# EAGLE design schema (EAGLE 4.13)
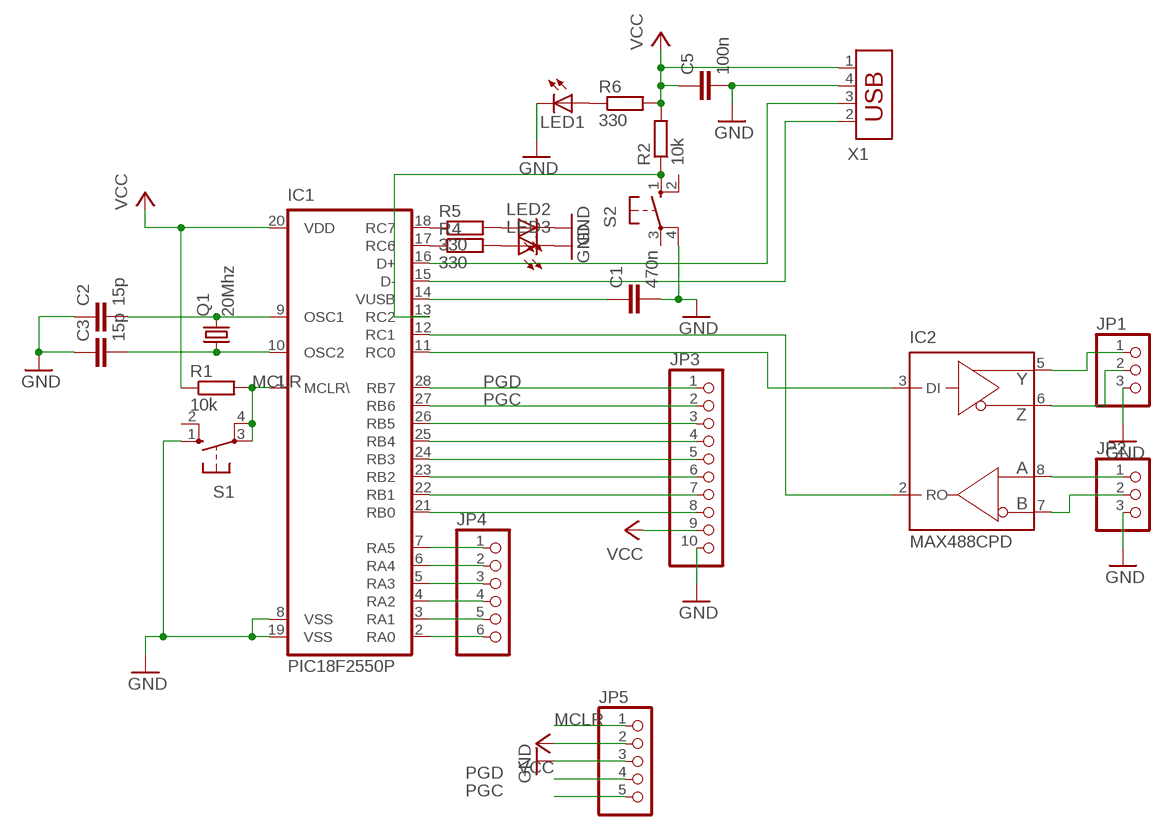
[diagram p0: schematic, sheet 1]

## Parts
C1  470n  C-EUC1206  [C1206]
C2  15p  C-EUC1206  [C1206]
C3  15p  C-EUC1206  [C1206]
C5  100n  C-EUC1206  [C1206]
IC1  PIC18F2550P  [DIL28-3]
IC2  MAX488CPD  [DIL08]
JP1  PINHD-1X3  [1X03]
JP2  PINHD-1X3  [1X03]
JP3  PINHD-1X10  [1X10]
JP4  PINHD-1X6  [1X06]
JP5  PINHD-1X5  [1X05]
LED1  LEDCHIPLED_1206  [CHIPLED_1206]
LED2  LEDCHIPLED_1206  [CHIPLED_1206]
LED3  LEDCHIPLED_1206  [CHIPLED_1206]
Q1  20Mhz  CRYTALHC49U-V  [HC49U-V]
R1  10k  R-EU_R1206  [R1206]
R2  10k  R-EU_R1206  [R1206]
R4  330  R-EU_R1206  [R1206]
R5  330  R-EU_R1206  [R1206]
R6  330  R-EU_R1206  [R1206]
S1  10-XX  [B3F-10XX]
S2  10-XX  [B3F-10XX]
X1  USB-787616  [USB]

## Nets
GND: C1.2 C2.1 C3.1 C5.2 IC1.8(VSS) IC1.19(VSS) JP1.3 JP2.3 JP3.10 JP5.3 LED1.C LED2.C LED3.C S1.1(S) S2.4(P1) X1.4
MCLR: IC1.1(MCLR\) JP5.1 R1.2 S1.3(P) S1.4(P1)
N$1: IC1.15(D-) X1.2
N$2: IC1.16(D+) X1.3
N$3: C1.1 IC1.14(VUSB)
N$4: C2.2 IC1.9(OSC1) Q1.2
N$5: C3.2 IC1.10(OSC2) Q1.1
N$6: IC1.11(RC0) IC2.3(DI)
N$8: IC1.12(RC1) IC2.2(RO)
N$9: IC1.7(RA5) JP4.1
N$10: IC1.13(RC2) R2.1 S2.1(S)
N$11: IC1.17(RC6) R4.1
N$12: IC1.18(RC7) R5.1
N$13: LED1.A R6.1
N$14: LED2.A R5.2
N$15: LED3.A R4.2
N$16: IC1.6(RA4) JP4.2
N$17: IC2.5(Y) JP1.1
N$18: IC2.6(Z) JP1.2
N$20: IC2.8(A) JP2.1
N$21: IC2.7(B) JP2.2
N$23: IC1.26(RB5) JP3.3
N$24: IC1.25(RB4) JP3.4
N$25: IC1.24(RB3) JP3.5
N$26: IC1.23(RB2) JP3.6
N$27: IC1.22(RB1) JP3.7
N$28: IC1.21(RB0) JP3.8
N$29: IC1.5(RA3) JP4.3
N$30: IC1.4(RA2) JP4.4
N$31: IC1.3(RA1) JP4.5
N$32: IC1.2(RA0) JP4.6
PGC: IC1.27(RB6) JP3.2 JP5.5
PGD: IC1.28(RB7) JP3.1 JP5.4
VCC: C5.1 IC1.20(VDD) JP3.9 JP5.2 R1.1 R2.2 R6.2 X1.1
Unconnected: S1.2(S1) S2.2(S1) S2.3(P)

## Power pins joined to a net without a drawn wire
GND: IC2.4(GND)
VCC: IC2.1(VCC)

## Library data of the parts
C1-C3 C5 = rcl:C-EU: CAPACITOR, European symbol
IC1 = PICs:PIC18F2550: MICROCONTROLLER EPROM/ROM-based
IC2 = maxim:MAX488: RS485 TRANSEIVER
JP1 JP2 = pinhead:PINHD-1X3: PIN HEADER
JP3 = pinhead:PINHD-1X10: PIN HEADER
JP4 = pinhead:PINHD-1X6: PIN HEADER
JP5 = pinhead:PINHD-1X5: PIN HEADER
LED1-LED3 = led:LED: LED OSRAM: - CHIPLED LG R971, LG N971, LY N971, LG Q971, LY Q971, LO R971, LY R971 LH N974, LH R974 LS Q976, LO Q976, LY Q976 LO Q996 - Hyper CHIPLED LW Q18S LB Q993, LB Q99A, LB R99A - SideLED LS A670, LO A670, LY A670, LG A670, LP A670 LB A673, LV A673, LT A673, LW A673 LH A674 LY A675 LS A676, LA A676, LO A676, LY A676, LW A676 LS A679, LY A679, LG A679 - Hyper Micro SIDELED® LS Y876, LA Y876, LO Y876, LY Y876 LT Y87S - SmartLED LW L88C, LW L88S LB L89C, LB L89S, LG L890 LS L89K, LO L89K, LY L89K LS L896, LA L896, LO L896, LY L896 - TOPLED LS T670, LO T670, LY T670, LG T670, LP T670 LSG T670, LSP T670, LSY T670, LOP T670, LYG T670 LG T671, LOG T671, LSG T671 LB T673, LV T673, LT T673, LW T673 LH T674 LS T676, LA T676, LO T676, LY T676, LB T676, LH T676, LSB T676, LW T676 LB T67C, LV T67C, LT T67C, LS T67K, LO T67K, LY T67K, LW E67C LS E67B, LA E67B, LO E67B, LY E67B, LB E67C, LV E67C, LT E67C LW T67C LS T679, LY T679, LG T679 LS T770, LO T770, LY T770, LG T770, LP T770 LB T773, LV T773, LT T773, LW T773 LH T774 LS E675, LA E675, LY E675, LS T675 LS T776, LA T776, LO T776, LY T776, LB T776 LHGB T686 LT T68C, LB T68C - Hyper Mini TOPLED® LB M676 - Mini TOPLED Santana® LG M470 LS M47K, LO M47K, LY M47K Source: http://www.osram.convergy.de/
Q1 = crystal:CRYTAL: CRYSTAL
R1 R2 R4-R6 = rcl:R-EU_: RESISTOR, European symbol
S1 S2 = switch-omron:10-XX: OMRON SWITCH
X1 = PICs:USB-787616: AMP connector

## Board
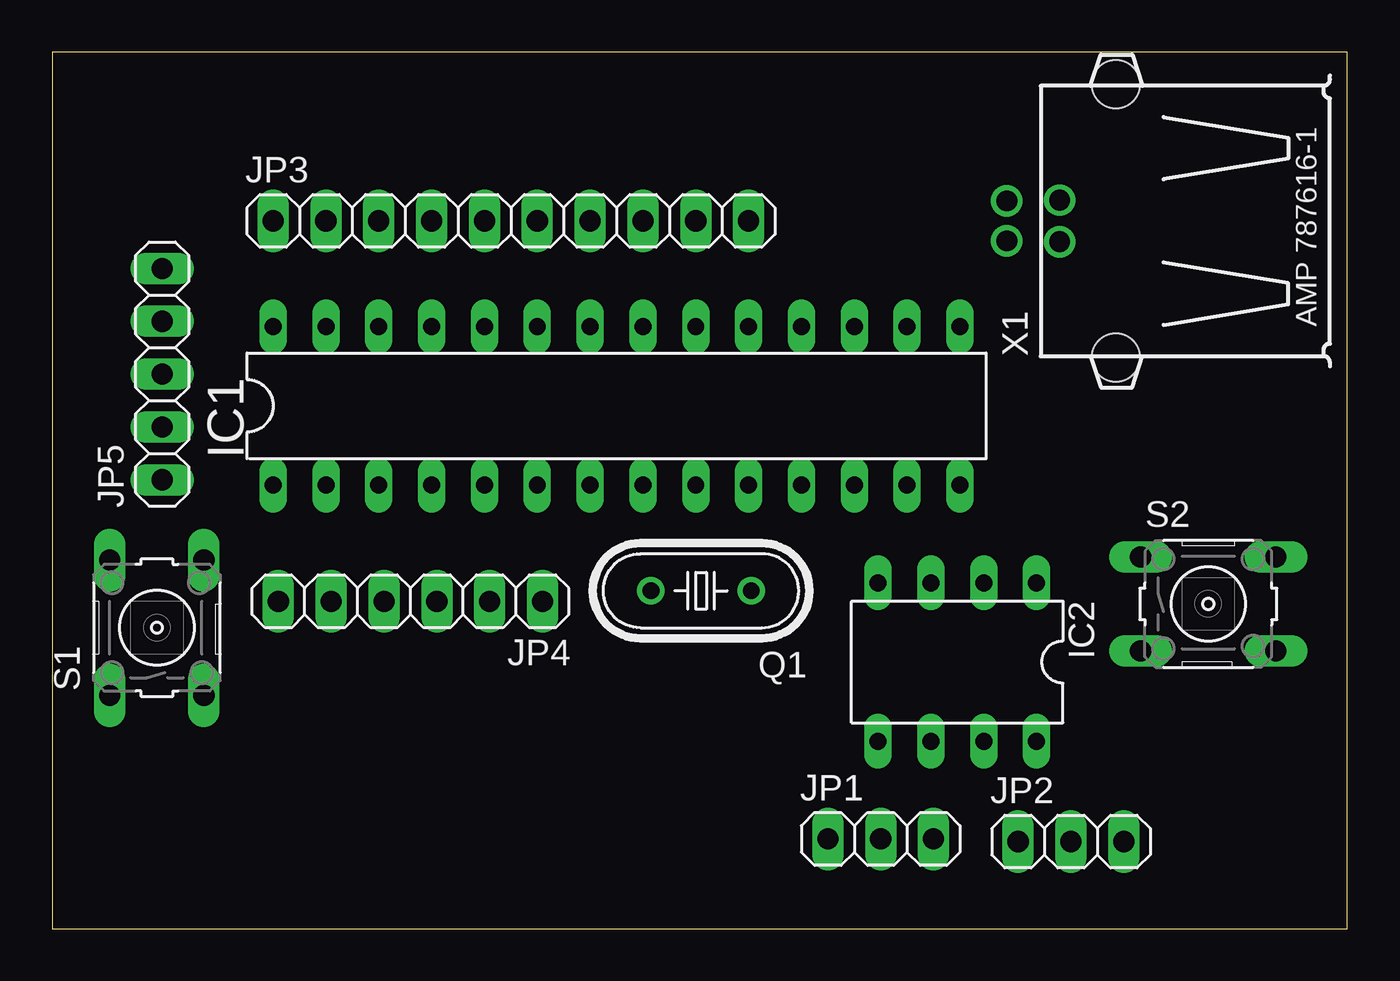
[diagram p1: board, top side]
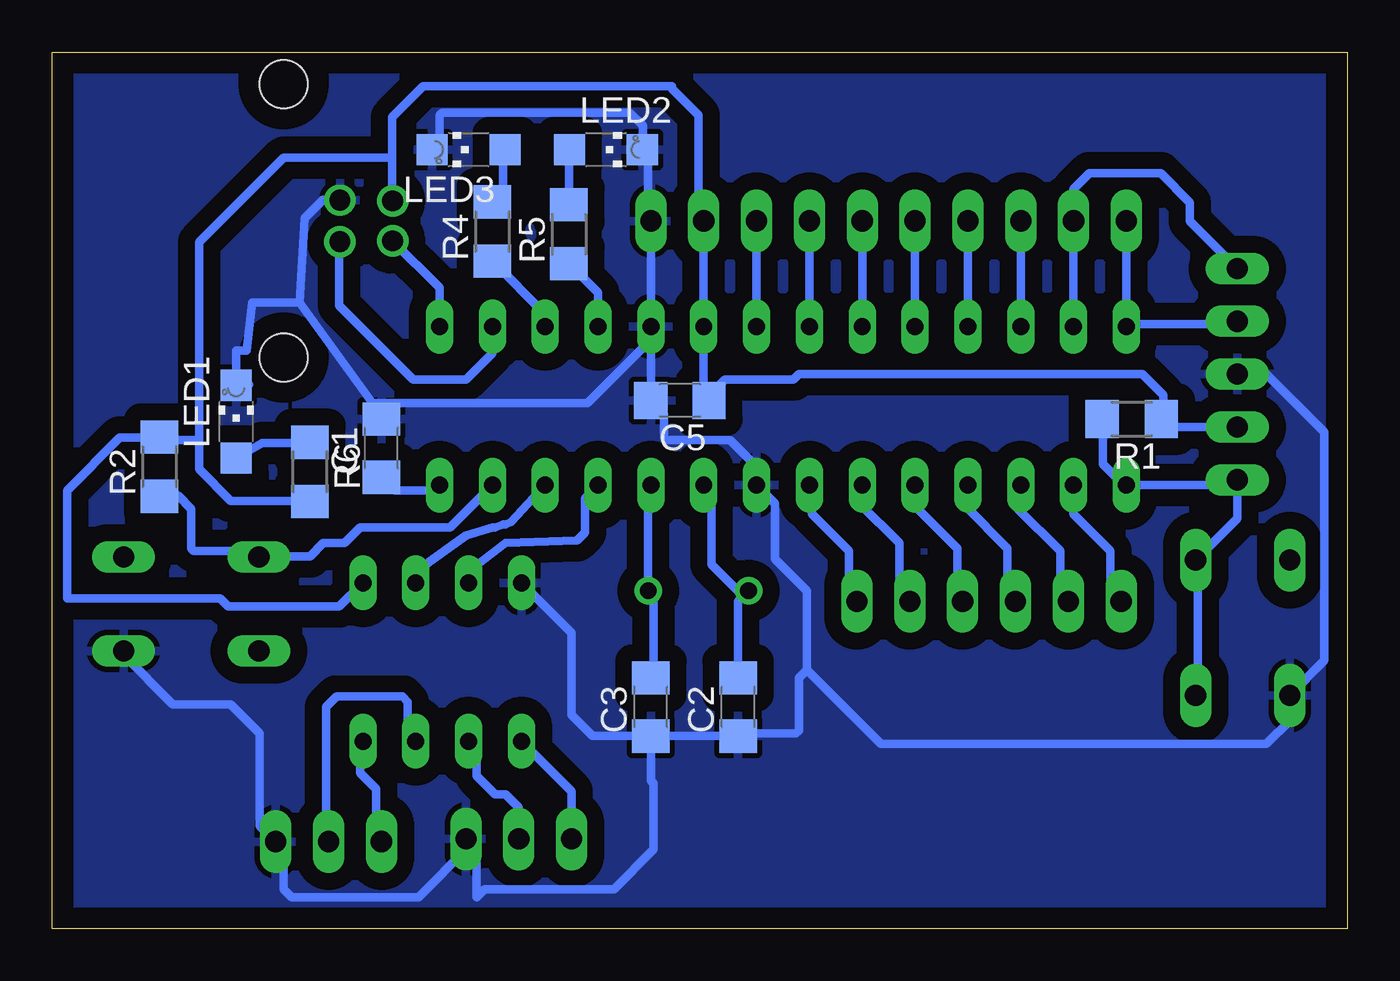
[diagram p2: board, bottom side, seen from below]

Size 62.28 x 42.15 mm. Coordinates in mm from the lower left corner, seen from the top.
Outline: 0,0 62.28,0 62.28,42.15 0,42.15 0,0
Copper layers (1*16): Top 0.035mm / dielectric 1.5mm / Bottom 0.035mm
Design rules "default": minimum track width 10mil, minimum drill 24mil, track to track 0.3mm, track to pad 0.3mm, pad to pad 0.3mm, via to via 0.3mm, smd to smd 0.3mm, copper to edge 40mil, drill to drill 8mil, minimum pad ring 10mil, minimum via ring 8mil, stop-mask expansion 4mil, vias tented up to drill 0mil, thermal gap 10mil

### Footprints (pad centres in the part's own frame; a part is rotated, then mirrored left to right if it is on the bottom)
C1206 = smd 1.6 x 1.8: 1 -1.4,0; 2 1.4,0
DIL28-3 = drill 0.813 long: 1 -16.51,-3.81; 2 -13.97,-3.81; 3 -11.43,-3.81; 4 -8.89,-3.81; 5 -6.35,-3.81; 6 -3.81,-3.81; 7 -1.27,-3.81; 8 1.27,-3.81; 9 3.81,-3.81; 10 6.35,-3.81; 11 8.89,-3.81; 12 11.43,-3.81; 13 13.97,-3.81; 14 16.51,-3.81; 15 16.51,3.81; 16 13.97,3.81; 17 11.43,3.81; 18 8.89,3.81; 19 6.35,3.81; 20 3.81,3.81; 21 1.27,3.81; 22 -1.27,3.81; 23 -3.81,3.81; 24 -6.35,3.81; 25 -8.89,3.81; 26 -11.43,3.81; 27 -13.97,3.81; 28 -16.51,3.81
DIL08 = drill 0.813 long: 1 -3.81,-3.81; 2 -1.27,-3.81; 3 1.27,-3.81; 4 3.81,-3.81; 5 3.81,3.81; 6 1.27,3.81; 7 -1.27,3.81; 8 -3.81,3.81
1X03 = drill 1.016 long: 1 -2.54,0; 2 0,0; 3 2.54,0
1X10 = drill 1.016 long: 1 -11.43,0; 2 -8.89,0; 3 -6.35,0; 4 -3.81,0; 5 -1.27,0; 6 1.27,0; 7 3.81,0; 8 6.35,0; 9 8.89,0; 10 11.43,0
1X06 = drill 1.016 long: 1 -6.35,0; 2 -3.81,0; 3 -1.27,0; 4 1.27,0; 5 3.81,0; 6 6.35,0
1X05 = drill 1.016 long: 1 -5.08,0; 2 -2.54,0; 3 0,0; 4 2.54,0; 5 5.08,0
CHIPLED_1206 = smd 1.5 x 1.5: A 0,-1.75; C 0,1.75
HC49U-V = drill 0.813 round: 1 -2.413,0; 2 2.413,0
R1206 = smd 1.6 x 1.803: 1 -1.422,0; 2 1.422,0
B3F-10XX = drill 1.016 long: 1 -3.251,2.261; 2 3.251,2.261; 3 -3.251,-2.261; 4 3.251,-2.261
USB = drill 1 round: 1 0.96,15.53; 2 -0.96,15.53; 3 -1,12.99; 4 1,12.99 | hole 2.3: -6.57,10.28; 6.57,10.28

### Placement (x,y rotation side)
C1  46.44,23.11 90 bottom
C2  29.3,10.66 90 bottom
C3  33.49,10.66 90 bottom
C5  32.09,25.39 180 bottom
IC1  27.14,25.14 0 top
IC2  43.52,12.82 180 top
JP1  39.84,4.31 0 top
JP2  48.98,4.19 0 top
JP3  22.06,34.03 0 top
JP4  17.23,15.74 180 top
JP5  5.3,26.67 90 top
LED1  53.43,24.38 0 bottom
LED2  35.65,37.46 270 bottom
LED3  42.25,37.46 90 bottom
Q1  31.2,16.25 180 top
R1  10.38,24.51 180 bottom
R2  57.11,22.22 90 bottom
R4  41.11,33.52 90 bottom
R5  37.43,33.4 90 bottom
R6  49.87,21.97 270 bottom
S1  5.04,14.47 90 top
S2  55.59,15.62 0 top
X1  61.43,34.03 90 top

### Tracks (layer width: path | path; a pad name or v marks a point on that pad's centre or on a via)
GND
  Bottom 0.406: 33.49,29.08 JP3.10 33.62,34.03 33.62,37.18 LED2.C 33.87,37.43 | X1.4 48.46,35.05 49.24,35.05 50.13,34.16 50.38,30.09 | 46.95,25.39 46.83,25.27 36.54,25.27 33.49,28.32 33.49,29.08 | 46.95,25.39 50.38,30.09 | 33.49,29.08 IC1.19 | 33.62,25.39 33.49,25.52 33.49,29.08 | LED3.C 43.65,37.81 43.65,39.11 43.52,39.24 34.51,39.24 33.87,38.6 33.87,37.43 | 33.87,37.43 33.87,37.21 | C3.1 33.74,9.27 | C3.1 | 33.24,9.27 C2.1 29.43,9.39 26.51,9.39 26.38,9.52 26.38,12.06 26,12.44 | 33.24,9.27 C3.1 | C1.2 46.95,25.02 46.95,25.39 | 5.42,26.67 JP5.3 3.9,26.67 1.11,23.87 1.11,12.9 S1.1 2.76,11.25 | 26,12.44 26,16.25 27.52,17.78 27.52,20.44 IC1.8 28.41,22.22 29.68,23.49 32.73,23.49 32.85,23.62 32.85,24.76 C5.2 | 26,12.44 22.44,8.89 3.9,8.89 2.76,10.03 2.76,11.25 | 2.76,11.25 2.76,11.3 | 50.38,30.09 52.67,30.09 52.92,27.81 53.43,27.81 LED1.C 52.79,26.16 | 42.25,4.31 JP1.3 | 42.25,4.31 42.25,3.93 44.67,1.52 50.76,1.52 51.14,1.9 51.14,3.8 JP2.3 52.29,4.95 52.29,9.39 53.68,10.79 56.48,10.79 58.89,13.2 58.89,13.3 S2.4 | 42.25,4.31 41.87,3.93 41.87,1.52 41.49,1.9 35.27,1.9 33.36,3.8 33.36,6.98 33.49,7.11 C3.1 | IC2.4 37.3,14.22 37.3,10.28 36.28,9.27 33.24,9.27 | 33.24,9.27 C3.1
  pour Bottom (isolate 0.813): -0.04,42.16 62.19,42.16 62.19,0.12 -0.04,0.12
MCLR
  Bottom 0.406: JP5.1 5.55,21.33 IC1.1 10.76,21.33 11.77,22.35 11.77,24.48 R1.2 | JP5.1 5.3,21.71 | JP5.1 5.3,19.73 S1.4 7.2,17.72 7.2,11.22 | 7.2,11.22 7.2,11.04 | S1.3 7.2,11.22
N$1
  Bottom 0.406: X1.2 43.65,30.82 IC1.15
N$2
  Bottom 0.406: IC1.16 41.11,27.68 42.38,26.41 44.92,26.41 48.48,29.97 48.48,33.02 48.46,33.02 X1.3
N$3
  Bottom 0.406: IC1.14 43.52,21.2 43.52,21.08 45.81,21.08 C1.1
N$4
  Bottom 0.406: IC1.9 30.57,20.95 30.57,17.52 29.3,16.25 Q1.2 29.3,15.74 C2.2 29.3,11.93
N$5
  Bottom 0.406: IC1.10 33.62,21.2 Q1.1 33.36,16 33.36,12.06 C3.2
N$6
  Bottom 0.406: IC1.11 36.66,20.7 36.66,19.04 37.05,18.66 40.48,18.54 42.13,17.27 42.13,16.63 IC2.3
N$8
  Bottom 0.406: IC1.12 40.22,19.55 40.48,19.43 40.6,19.43 40.98,19.3 41.11,19.3 42.38,18.92 44.67,17.27 44.67,16.63 IC2.2
N$9
  Bottom 0.406: JP4.1 23.96,16.12 23.96,18.16 25.74,19.93 25.74,21.2 IC1.7
N$10
  Bottom 0.406: IC1.13 43.14,19.3 47.46,19.3 48.22,18.54 49.24,18.54 49.87,17.9 52.31,17.9 S2.1 52.62,18.16 55.46,18.16 55.59,18.28 55.59,20.19 56.22,20.82 57.14,20.82 | 57.14,20.82 57.37,20.82 | 57.14,20.82 R2.1
N$11
  Bottom 0.406: R4.1 38.57,29.56 IC1.17
N$12
  Bottom 0.406: R5.1 36.03,30.58 IC1.18
N$13
  Bottom 0.406: 49.85,23.36 49.62,23.36 | R6.1 49.85,23.36 | LED1.A 52.19,23.36 49.85,23.36
N$14
  Bottom 0.406: 37.43,34.79 R5.2 37.43,37.43 LED2.A
N$15
  Bottom 0.406: 40.6,37.56 40.6,37.59 | LED3.A 40.6,37.56 | R4.2 40.6,35.45 40.6,37.56
N$16
  Bottom 0.406: JP4.2 21.55,16.25 21.55,18.54 23.46,20.44 23.46,21.2 IC1.6
N$17
  Bottom 0.406: 37.3,4.19 JP1.1 37.3,6.6 IC2.5
N$18
  Bottom 0.406: IC2.6 41.87,8.63 41.87,7.36 40.98,6.47 40.48,6.47 39.84,5.84 JP1.2
N$20
  Bottom 0.406: JP2.1 46.7,4.44 46.7,6.73 47.46,7.49 47.46,9.01 IC2.8
N$21
  Bottom 0.406: IC2.7 45.17,9.39 45.17,10.92 45.43,11.17 48.6,11.17 49.11,10.66 49.11,4.19 JP2.2
N$23
  Bottom 0.406: IC1.26 JP3.3
N$24
  Bottom 0.406: IC1.25 JP3.4
N$25
  Bottom 0.406: IC1.24 JP3.5
N$26
  Bottom 0.406: IC1.23 JP3.6
N$27
  Bottom 0.406: IC1.22 JP3.7
N$28
  Bottom 0.406: IC1.21 JP3.8
N$29
  Bottom 0.406: JP4.3 18.76,16 18.76,18.28 20.92,20.44 20.92,21.33 IC1.5
N$30
  Bottom 0.406: JP4.4 16.34,16.12 16.34,18.28 18.38,20.32 18.38,21.33 IC1.4
N$31
  Bottom 0.406: JP4.5 13.8,16.12 13.8,18.16 15.84,20.19 15.84,21.33 IC1.3
N$32
  Bottom 0.406: JP4.6 11.39,16.25 11.39,18.16 13.17,19.93 IC1.2 13.17,21.46
PGC
  Bottom 0.406: IC1.27 JP3.2 13.17,35.56 12.41,36.32 8.98,36.32 7.58,34.92 7.58,34.03 JP5.5
PGD
  Bottom 0.406: JP3.1 IC1.28 10.5,29.08 5.17,29.08 | 5.17,29.08 5.04,29.08 | JP5.4 5.17,29.08
VCC
  Bottom 0.406: 31.08,35.05 31.08,34.67 30.95,34.54 JP3.9 | JP3.9 IC1.20 30.95,25.65 30.82,25.52 | JP3.9 31.2,34.28 31.2,39.11 32.47,40.38 32.47,40.51 44.45,40.51 45.94,39.02 45.94,36.95 | 45.94,34.95 45.94,34.92 | 45.94,34.95 X1.1 | 5.17,24.13 JP5.2 8.57,24.13 R1.1 8.85,24.61 8.85,25.65 9.87,26.67 26.38,26.67 26.63,26.41 29.93,26.41 30.82,25.52 | 45.94,36.95 45.94,34.95 | 45.94,36.95 46.06,37.08 51.14,37.08 55.21,33.02 55.21,23.49 | 55.21,23.49 55.21,22.09 53.68,20.57 49.85,20.57 | 49.85,20.57 49.75,20.57 | 49.85,20.57 R6.2 | 55.21,23.49 56.96,23.49 R2.2 57.14,23.62 59.02,23.62 61.56,21.08 61.56,15.87 54.19,15.87 53.81,15.49 48.48,15.49 IC2.1 | C5.1 30.7,25.52 30.82,25.52